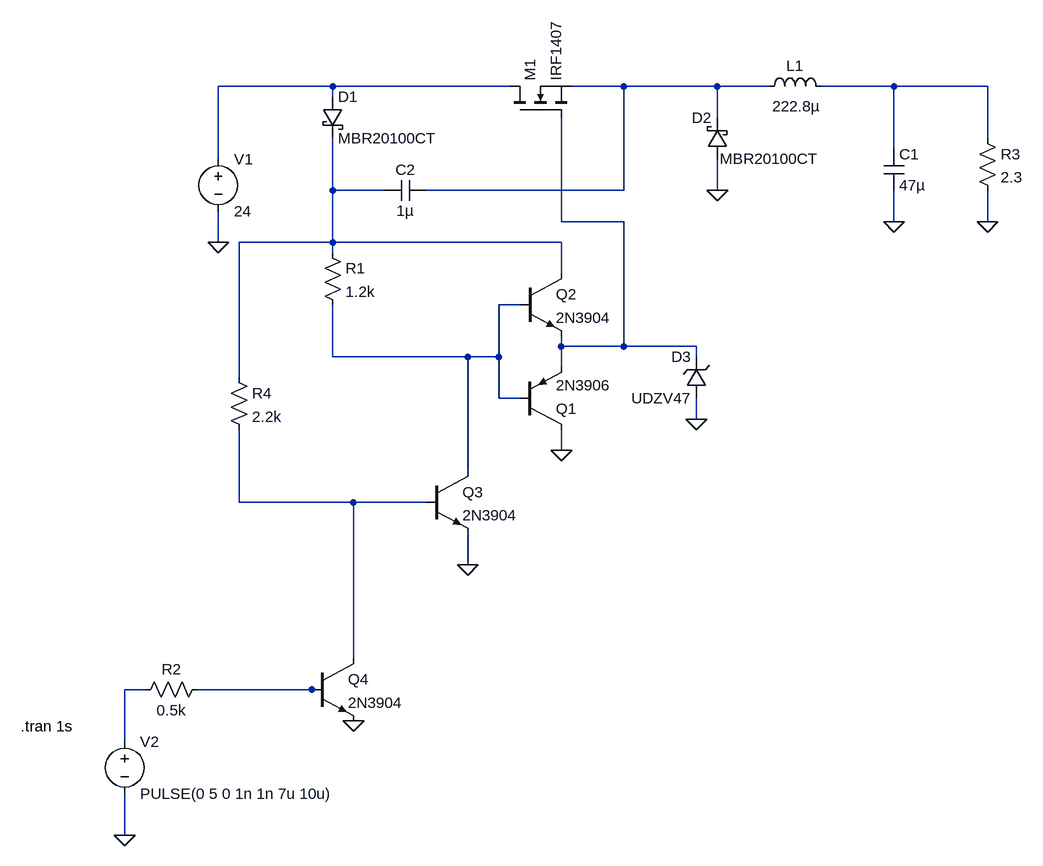
[diagram p0: schematic BuckConverter_03.asc]
BuckConverter_03.asc, the LTspice schematic file:
Version 4
SHEET 1 972 1028
WIRE -96 -144 -272 -144
WIRE 176 -144 -96 -144
WIRE 352 -144 272 -144
WIRE 496 -144 352 -144
WIRE 576 -144 496 -144
WIRE 768 -144 656 -144
WIRE 912 -144 768 -144
WIRE -96 -128 -96 -144
WIRE 496 -96 496 -144
WIRE 912 -64 912 -144
WIRE 768 -48 768 -144
WIRE -272 -32 -272 -144
WIRE -96 16 -96 -64
WIRE -16 16 -96 16
WIRE 352 16 352 -144
WIRE 352 16 48 16
WIRE 496 16 496 -32
WIRE 256 64 256 -96
WIRE 352 64 256 64
WIRE 768 64 768 16
WIRE 912 64 912 16
WIRE -272 96 -272 48
WIRE -96 96 -96 16
WIRE -96 96 -240 96
WIRE 256 96 -96 96
WIRE -96 112 -96 96
WIRE 256 144 256 96
WIRE 192 192 160 192
WIRE 256 256 256 240
WIRE 352 256 352 64
WIRE 352 256 256 256
WIRE 464 256 352 256
WIRE -96 272 -96 192
WIRE 112 272 -96 272
WIRE 160 272 160 192
WIRE 160 272 112 272
WIRE 464 272 464 256
WIRE 256 288 256 256
WIRE -240 304 -240 96
WIRE 160 336 160 272
WIRE 192 336 160 336
WIRE 464 368 464 336
WIRE 256 416 256 384
WIRE 112 448 112 272
WIRE -240 496 -240 384
WIRE -64 496 -240 496
WIRE 48 496 -64 496
WIRE 112 592 112 544
WIRE -64 736 -64 496
WIRE -384 784 -416 784
WIRE -128 784 -304 784
WIRE -112 784 -128 784
WIRE -416 864 -416 784
WIRE -416 1008 -416 944
FLAG 496 16 0
FLAG 768 64 0
FLAG 912 64 0
FLAG 256 416 0
FLAG -272 96 0
FLAG -416 1008 0
FLAG 112 592 0
FLAG -64 832 0
FLAG 464 368 0
SYMBOL pnp 192 384 M180
SYMATTR InstName Q1
SYMATTR Value 2N3906
SYMBOL npn 192 144 R0
SYMATTR InstName Q2
SYMATTR Value 2N3904
SYMBOL res -112 96 R0
SYMATTR InstName R1
SYMATTR Value 1.2k
SYMBOL res -288 768 R90
WINDOW 0 0 56 VBottom 2
WINDOW 3 32 56 VTop 2
SYMATTR InstName R2
SYMATTR Value 0.5k
SYMBOL res 896 -80 R0
SYMATTR InstName R3
SYMATTR Value 2.3
SYMBOL ind 560 -128 R270
WINDOW 0 32 56 VTop 2
WINDOW 3 1 58 VBottom 2
SYMATTR InstName L1
SYMATTR Value 222.8µ
SYMBOL cap 752 -48 R0
SYMATTR InstName C1
SYMATTR Value 47µ
SYMBOL nmos 176 -96 R270
SYMATTR InstName M1
SYMATTR Value IRF1407
SYMBOL voltage -272 -48 R0
WINDOW 123 0 0 Left 0
WINDOW 39 0 0 Left 0
SYMATTR InstName V1
SYMATTR Value 24
SYMBOL schottky -112 -128 R0
SYMATTR InstName D1
SYMATTR Value MBR20100CT
SYMATTR Description Diode
SYMATTR Type diode
SYMBOL schottky 512 -32 R180
WINDOW 0 24 64 Left 2
WINDOW 3 -141 1 Left 2
SYMATTR InstName D2
SYMATTR Value MBR20100CT
SYMATTR Description Diode
SYMATTR Type diode
SYMBOL cap 48 0 R90
WINDOW 0 0 32 VBottom 2
WINDOW 3 32 32 VTop 2
SYMATTR InstName C2
SYMATTR Value 1µ
SYMBOL voltage -416 848 R0
WINDOW 123 0 0 Left 0
WINDOW 39 0 0 Left 0
SYMATTR InstName V2
SYMATTR Value PULSE(0 5 0 1n 1n 7u 10u)
SYMBOL npn 48 448 R0
SYMATTR InstName Q3
SYMATTR Value 2N3904
SYMBOL npn -128 736 R0
SYMATTR InstName Q4
SYMATTR Value 2N3904
SYMBOL res -256 288 R0
SYMATTR InstName R4
SYMATTR Value 2.2k
SYMBOL zener 480 336 R180
WINDOW 0 24 64 Left 2
WINDOW 3 24 0 Left 2
SYMATTR InstName D3
SYMATTR Value UDZV47
SYMATTR Description Diode
SYMATTR Type diode
TEXT -576 840 Left 2 !.tran 1s

The netlist it stands for:
* BuckConverter_03.asc
Q1 0 N006 N005 0 2N3906
Q2 N004 N006 N005 0 2N3904
R1 N004 N006 1.2k
R2 N009 N008 0.5k
R3 N003 0 2.3
L1 N002 N003 222.8µ
C1 N003 0 47µ
M1 N001 N005 N002 N002 IRF1407
V1 N001 0 24
D1 N001 N004 MBR20100CT
D2 0 N002 MBR20100CT
C2 N002 N004 1µ
V2 N008 0 PULSE(0 5 0 1n 1n 7u 10u)
Q3 N006 N007 0 0 2N3904
Q4 N007 N009 0 0 2N3904
R4 N004 N007 2.2k
D3 0 N005 UDZV47
.model D D
.lib standard.dio
.model NPN NPN
.model PNP PNP
.lib standard.bjt
.model NMOS NMOS
.model PMOS PMOS
.lib standard.mos
.tran 1s
.backanno
.end